# EAGLE design fabflash-mk-2.3-controller (EAGLE 6.5.0)
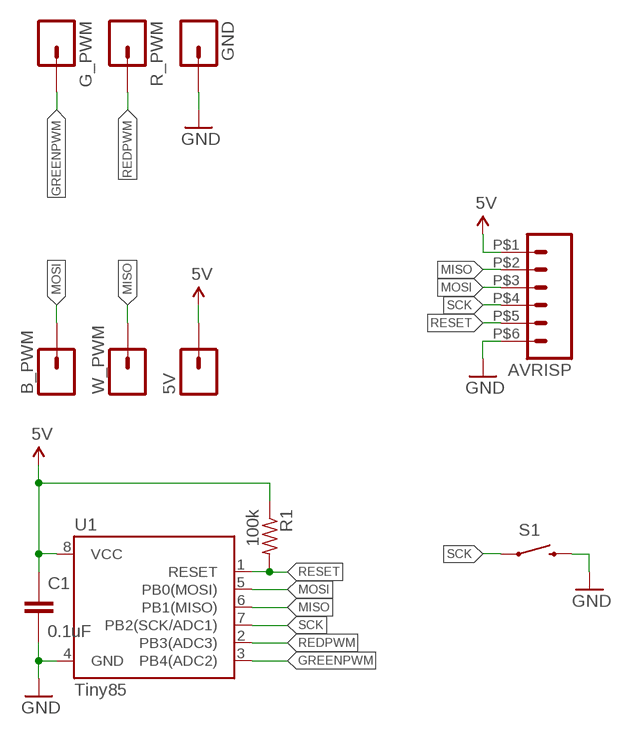
[diagram p0: schematic, sheet 1]

## Parts
5V  M01PTH-0.9MM  [1X01-0.9MM]
AVRISP  M06PTH-2MM-NS  [1X06-PTH-2MM-NS]
B_PWM  M01PTH-0.9MM  [1X01-0.9MM]
C1  0.1uF  CAPACITOR-CERAMICC0603  [C0603]
G_PWM  M01PTH-0.9MM  [1X01-0.9MM]
GND  M01PTH-0.9MM  [1X01-0.9MM]
R1  100k  RESISTORR0603  [R0603]
R_PWM  M01PTH-0.9MM  [1X01-0.9MM]
S1  SWITCH-MOMENTARY-2PTH  [TACTILE-PTH]
U1  Tiny85  ATTINY45TINY85-20-SOICW  [SO08-EIAJ]
W_PWM  M01PTH-0.9MM  [1X01-0.9MM]

## Nets
5V: 5V.1 AVRISP.P$1 C1.1 R1.1 U1.8(VCC)
GND: AVRISP.P$6 C1.2 GND.1 S1.3 S1.4 U1.4(GND)
GREENPWM: G_PWM.1 U1.3(PB4(ADC2))
MISO: AVRISP.P$2 U1.6(PB1(MISO)) W_PWM.1
MOSI: AVRISP.P$3 B_PWM.1 U1.5(PB0(MOSI))
REDPWM: R_PWM.1 U1.2(PB3(ADC3))
RESET: AVRISP.P$5 R1.2 U1.1(RESET)
SCK: AVRISP.P$4 S1.1 S1.2 U1.7(PB2(SCK/ADC1))

## Library data of the parts
5V B_PWM G_PWM GND R_PWM W_PWM = A_butts:M01: Header 1 Standard 1-pin 0.1" header. Use with straight break away headers (SKU : PRT-00116), right angle break away headers (PRT-00553), swiss pins (PRT-00743), machine pins (PRT-00117), and female headers (PRT-00115).
AVRISP = A_butts:M06: Header 6 Standard 6-pin 0.1" header. Use with straight break away headers (SKU : PRT-00116), right angle break away headers (PRT-00553), swiss pins (PRT-00743), machine pins (PRT-00117), and female headers (PRT-00115). Molex polarized connector foot print use with SKU : PRT-08094 with associated crimp pins and housings. NOTES ON THE VARIANTS LOCK and LOCK_LONGPADS... This footprint was designed to help hold the alignment of a through-hole component (i.e. 6-pin header) while soldering it into place. You may notice that each hole has been shifted either up or down by 0.005 of an inch from it's more standard position (which is a perfectly straight line). This slight alteration caused the pins (the squares in the middle) to touch the edges of the holes. Because they are alternating, it causes a "brace" to hold the component in place. 0.005 has proven to be the perfect amount of "off-center" position when using our standard breakaway headers. Although looks a little odd when you look at the bare footprint, once you have a header in there, the alteration is very hard to notice. Also,if you push a header all the way into place, it is covered up entirely on the bottom side. This idea of altering the position of holes to aid alignment will be further integrated into the Sparkfun Library for other footprints. It can help hold any component with 3 or more connection pins.
C1 = A_butts:CAPACITOR-CERAMIC: CAPACITOR, European symbol
R1 = A_butts:RESISTOR: RESISTOR, American symbol
S1 = A_butts:SWITCH-MOMENTARY-2: Various NO switches- pushbuttons, reed, etc
U1 = A_butts:ATTINY45: Atmel 8-pin 2/4/8kB flash uC; PROD_ID: IC-09092; VALUE: Tiny85-20-SMT

## Board
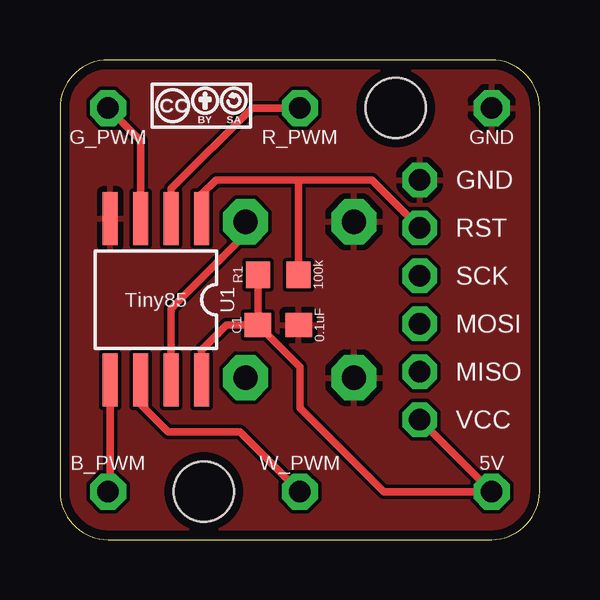
[diagram p1: board, top side]
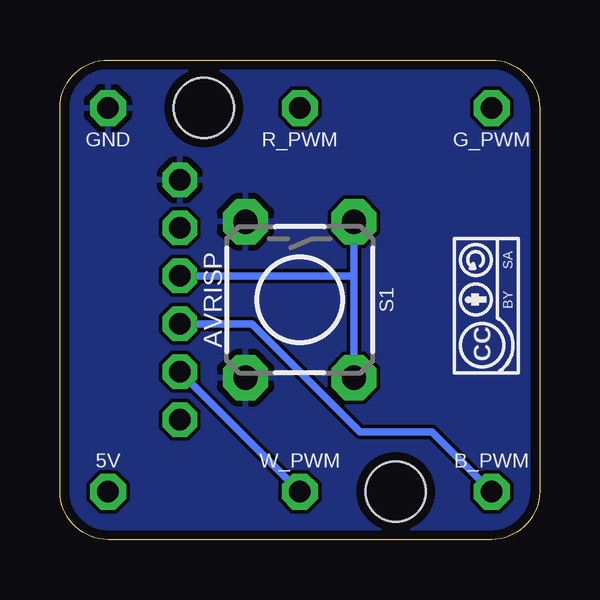
[diagram p2: board, bottom side, seen from below]

Size 20 x 20 mm. Coordinates in mm from the lower left corner, seen from the top.
Outline: 0,18 0,2 arc90 2,0 18,0 arc90 20,2 20,18 arc90 18,20 2,20 arc90 0,18
Copper layers (1*16): Top 0.0356mm / dielectric 1.5011mm / Bottom 0.0356mm
Design rules "LaenPCBOrder2": minimum track width 6mil, minimum drill 13mil, track to track 6mil, track to pad 6mil, pad to pad 6mil, via to via 6mil, smd to smd 6mil, copper to edge 15mil, drill to drill 6mil, minimum pad ring 7mil, minimum via ring 7mil, stop-mask expansion 3mil, vias tented up to drill 20mil, thermal gap 10mil
Holes 2.5 mm at 6,2 14,18

### Footprints (pad centres in the part's own frame; a part is rotated, then mirrored left to right if it is on the bottom)
1X01-0.9MM = drill 0.9 pad 1.5 octagon: 1 0,0
1X06-PTH-2MM-NS = drill 0.9 pad 1.422 octagon: P$1 -5,0; P$2 -3,0; P$3 -1,0; P$4 1,0; P$5 3,0; P$6 5,0
C0603 = smd 1.1 x 1: 1 -0.85,0; 2 0.85,0
R0603 = smd 1 x 1.1: 1 -0.85,0; 2 0.85,0
TACTILE-PTH = drill 1.016 pad 1.88 octagon: 1 -3.251,2.261; 2 3.251,2.261; 3 -3.251,-2.261; 4 3.251,-2.261
SO08-EIAJ = smd 0.61 x 2.21: 1 -1.905,-3.378; 2 -0.635,-3.378; 3 0.635,-3.378; 4 1.905,-3.378; 5 1.905,3.353; 6 0.635,3.353; 7 -0.635,3.353; 8 -1.905,3.353

### Placement (x,y rotation side)
5V  18,2 0 top
AVRISP  15,10 90 bottom
B_PWM  2,2 0 top
C1  9.1,8.95 0 top
G_PWM  2,18 180 top
GND  18,18 180 top
R1  9.1,11.05 0 top
R_PWM  10,18 180 top
S1  10,10 270 bottom
U1  4,10 180 top
U$1  [CC-BY-SA-4.0-NO-URL]  2.4,8.1 90 bottom
U$2  [CC-BY-SA-4.0-SMALL]  5.9,18.1 0 top
W_PWM  10,2 0 top

### Tracks (layer width: path | path; a pad name or v marks a point on that pad's centre or on a via)
5V
  Top 0.305: C1.1 6.95,8.95 5.91,7.91 U1.8 | C1.1 R1.1 | C1.1 10,7.2 10,5.5 13.5,2 5V.1 AVRISP.P$1
GND
  pour Top: 2,20 18,20 arc-90 20,18 20,2 arc-90 18,0 2,0 arc-90 0,2 0,18 arc-90
  pour Bottom: 2,20 18,20 arc-90 20,18 20,2 arc-90 18,0 2,0 arc-90 0,2 0,18 arc-90
GREENPWM
  Top 0.305: U1.3 3.37,16.64 G_PWM.1
MISO
  Top 0.305: U1.6 3.37,5.63 4.5,4.5 7.5,4.5 W_PWM.1
  Bottom 0.305: AVRISP.P$2 W_PWM.1
MOSI
  Top 0.305: U1.5 2.1,2.1 B_PWM.1
  Bottom 0.305: AVRISP.P$3 12,9 7.5,4.5 4.5,4.5 B_PWM.1
REDPWM
  Top 0.305: U1.2 4.63,14.63 8,18 R_PWM.1
RESET
  Top 0.305: U1.1 5.91,14.4 6.5,15 10,15 | 10,15 13,15 AVRISP.P$5 | R1.2 9.95,14.95 10,15
SCK
  Top 0.305: S1.1 7.74,12.74 4.63,9.63 U1.7
  Bottom 0.305: S1.2 7.74,11 | 7.74,11 S1.1 | AVRISP.P$4 7.74,11

### Text on the board
tPlace: GND | RST | SCK | MOSI | MISO | VCC
bPlace: G_PWM | R_PWM | GND | B_PWM | W_PWM | 5V